# EAGLE schematic LPC82X_TSSOP_breadboard (EAGLE 7.1.0)
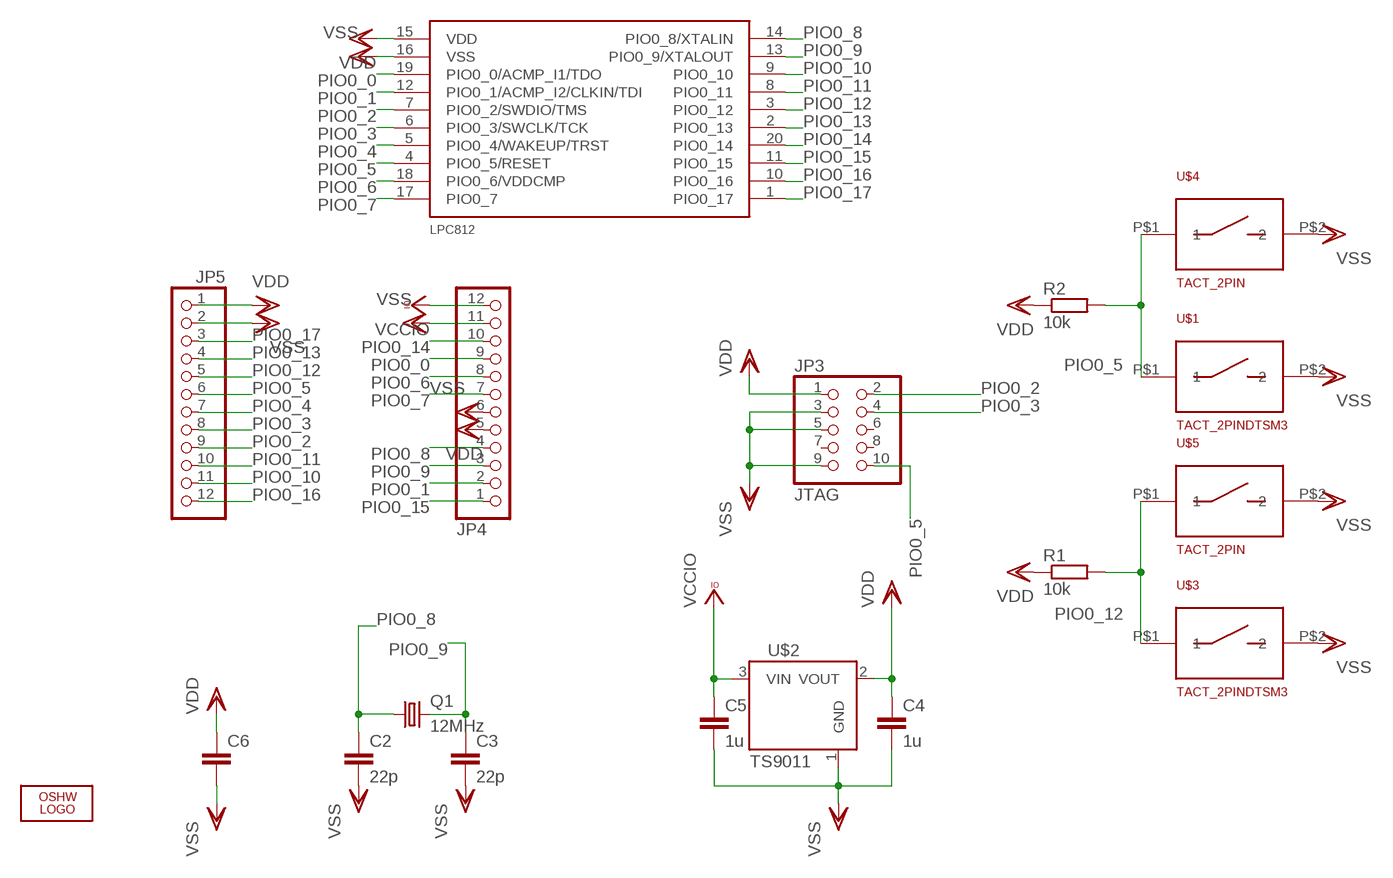
[diagram p0: schematic, sheet 1]

## Parts
C2  22p  C-EUC0603K  [C0603K]
C3  22p  C-EUC0603K  [C0603K]
C4  1u  C-EUC0805K  [C0805K]
C5  1u  C-EUC0805K  [C0805K]
C6  C-EUC0603K  [C0603K]
JP3  JTAG  PINHD-2X5SMD_1.27_SMD  [2X05_1.27_SMD]
JP4  PINHD-1X12NORM_OCT  [1X12_NORMAL_OCT]
JP5  PINHD-1X12NORM_OCT  [1X12_NORMAL_OCT]
LOGO2  OSHW_LOGO_FILLX0150-NT  [OSHW_FILLX150_NOTEXT]
LPC812  LPC812M101JDH20  [TSSOP20]
Q1  12MHz  CRYSTALSMD_5.0X3.2  [CRYSTAL_5.0X3.2]
R1  10k  R-EU_R0603  [R0603]
R2  10k  R-EU_R0603  [R0603]
U$1  TACT_2PINDTSM3  [DTSM3]
U$2  TS9011  [SOT23-3]
U$3  TACT_2PINDTSM3  [DTSM3]
U$4  TACT_2PIN  [TD-85XU]
U$5  TACT_2PIN  [TD-85XU]

## Nets
PIO0_0: JP4.9 LPC812.19(PIO0_0/ACMP_I1/TDO)
PIO0_1: JP4.2 LPC812.12(PIO0_1/ACMP_I2/CLKIN/TDI)
PIO0_2: JP3.2 JP5.9 LPC812.7(PIO0_2/SWDIO/TMS)
PIO0_3: JP3.4 JP5.8 LPC812.6(PIO0_3/SWCLK/TCK)
PIO0_4: JP5.7 LPC812.5(PIO0_4/WAKEUP/TRST)
PIO0_5: JP3.10 JP5.6 LPC812.4(PIO0_5/RESET) R2.2 U$1.P$1 U$4.P$1
PIO0_6: JP4.8 LPC812.18(PIO0_6/VDDCMP)
PIO0_7: JP4.7 LPC812.17(PIO0_7)
PIO0_8: C2.1 JP4.4 LPC812.14(PIO0_8/XTALIN) Q1.1
PIO0_9: C3.1 JP4.3 LPC812.13(PIO0_9/XTALOUT) Q1.2
PIO0_10: JP5.11 LPC812.9(PIO0_10)
PIO0_11: JP5.10 LPC812.8(PIO0_11)
PIO0_12: JP5.5 LPC812.3(PIO0_12) R1.2 U$3.P$1 U$5.P$1
PIO0_13: JP5.4 LPC812.2(PIO0_13)
PIO0_14: JP4.10 LPC812.20(PIO0_14)
PIO0_15: JP4.1 LPC812.11(PIO0_15)
PIO0_16: JP5.12 LPC812.10(PIO0_16)
PIO0_17: JP5.3 LPC812.1(PIO0_17)
VCCIO: C5.1 JP4.12 U$2.3(VIN)
VDD: C4.1 C6.1 JP3.1 JP4.5 JP5.1 LPC812.15(VDD) R1.1 R2.1 U$2.2(VOUT)
VSS: C2.2 C3.2 C4.2 C5.2 C6.2 JP3.3 JP3.5 JP3.9 JP4.6 JP4.11 JP5.2 LPC812.16(VSS) U$1.P$2 U$2.1(GND) U$3.P$2 U$4.P$2 U$5.P$2
Unconnected: JP3.6 JP3.7 JP3.8

## Library data of the parts
C2 C3 C6 = SquantorRCL:C-EU: CAPACITOR, European symbol
C4 C5 = bart_rcl:C-EU: CAPACITOR, European symbol
JP3 = SquantorConnectors:PINHD-2X5: PIN HEADER
JP4 JP5 = SquantorConnectors:PINHD-1X12: PIN HEADER
LOGO2 = ohw-logo:OSHW_LOGO_FILL
LPC812 = LPC800:LPC812M101JDH20
Q1 = bart_crystals:CRYSTAL: CRYSTAL
R1 R2 = bart_rcl:R-EU_: RESISTOR, European symbol
U$1 U$3-U$5 = SquantorButtons:TACT_2PIN
U$2 = bart_ic:TS9011